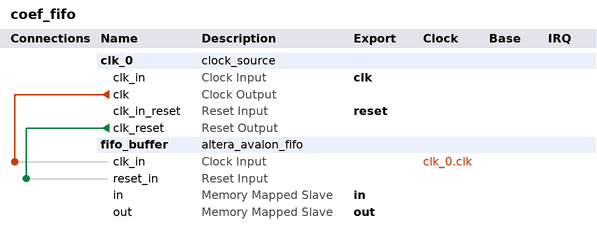
[diagram p0: system contents]
# Platform Designer (Qsys) system coef_fifo, Cyclone V 5CSEMA5F31C6
# Parameters at their usual value, and those the tool derives, are not listed.
package require -exact qsys 17.1
create_system coef_fifo
set_project_property DEVICE_FAMILY {Cyclone V}
set_project_property DEVICE 5CSEMA5F31C6

add_instance clk_0 clock_source 17.1
set_instance_parameter_value clk_0 clockFrequency 50000000

add_instance fifo_buffer altera_avalon_fifo 17.1
set_instance_parameter_value fifo_buffer avalonMMAvalonMMDataWidth 16
set_instance_parameter_value fifo_buffer bitsPerSymbol 16
set_instance_parameter_value fifo_buffer channelWidth 8
set_instance_parameter_value fifo_buffer errorWidth 8
set_instance_parameter_value fifo_buffer fifoDepth 512
set_instance_parameter_value fifo_buffer fifoInputInterfaceOptions AVALONMM_WRITE
set_instance_parameter_value fifo_buffer fifoOutputInterfaceOptions AVALONMM_READ
set_instance_parameter_value fifo_buffer singleClockMode true
set_instance_parameter_value fifo_buffer symbolsPerBeat 2
set_instance_parameter_value fifo_buffer useBackpressure false
set_instance_parameter_value fifo_buffer useIRQ true
set_instance_parameter_value fifo_buffer usePacket true
set_instance_parameter_value fifo_buffer useReadControl false
set_instance_parameter_value fifo_buffer useWriteControl false

# connections
add_connection clk_0.clk fifo_buffer.clk_in clock
add_connection clk_0.clk_reset fifo_buffer.reset_in reset

# exported interfaces
add_interface clk clock sink
set_interface_property clk EXPORT_OF clk_0.clk_in
add_interface in avalon slave
set_interface_property in EXPORT_OF fifo_buffer.in
add_interface out avalon slave
set_interface_property out EXPORT_OF fifo_buffer.out
add_interface reset reset sink
set_interface_property reset EXPORT_OF clk_0.clk_in_reset

set_interconnect_requirement {$system} qsys_mm.clockCrossingAdapter HANDSHAKE
set_interconnect_requirement {$system} qsys_mm.enableEccProtection FALSE
set_interconnect_requirement {$system} qsys_mm.insertDefaultSlave FALSE
set_interconnect_requirement {$system} qsys_mm.maxAdditionalLatency 1

save_system coef_fifo.qsys
